# Altium schematic sheet [06] - Audio In-Out.SchDoc: Audio In-Out
size A3; DrawnBy: Farogh; Organization: Farogh Iftekhar; Address1: Defence Coloney; Address2: New Delhi; Revision: V1I0; SheetNumber: 6
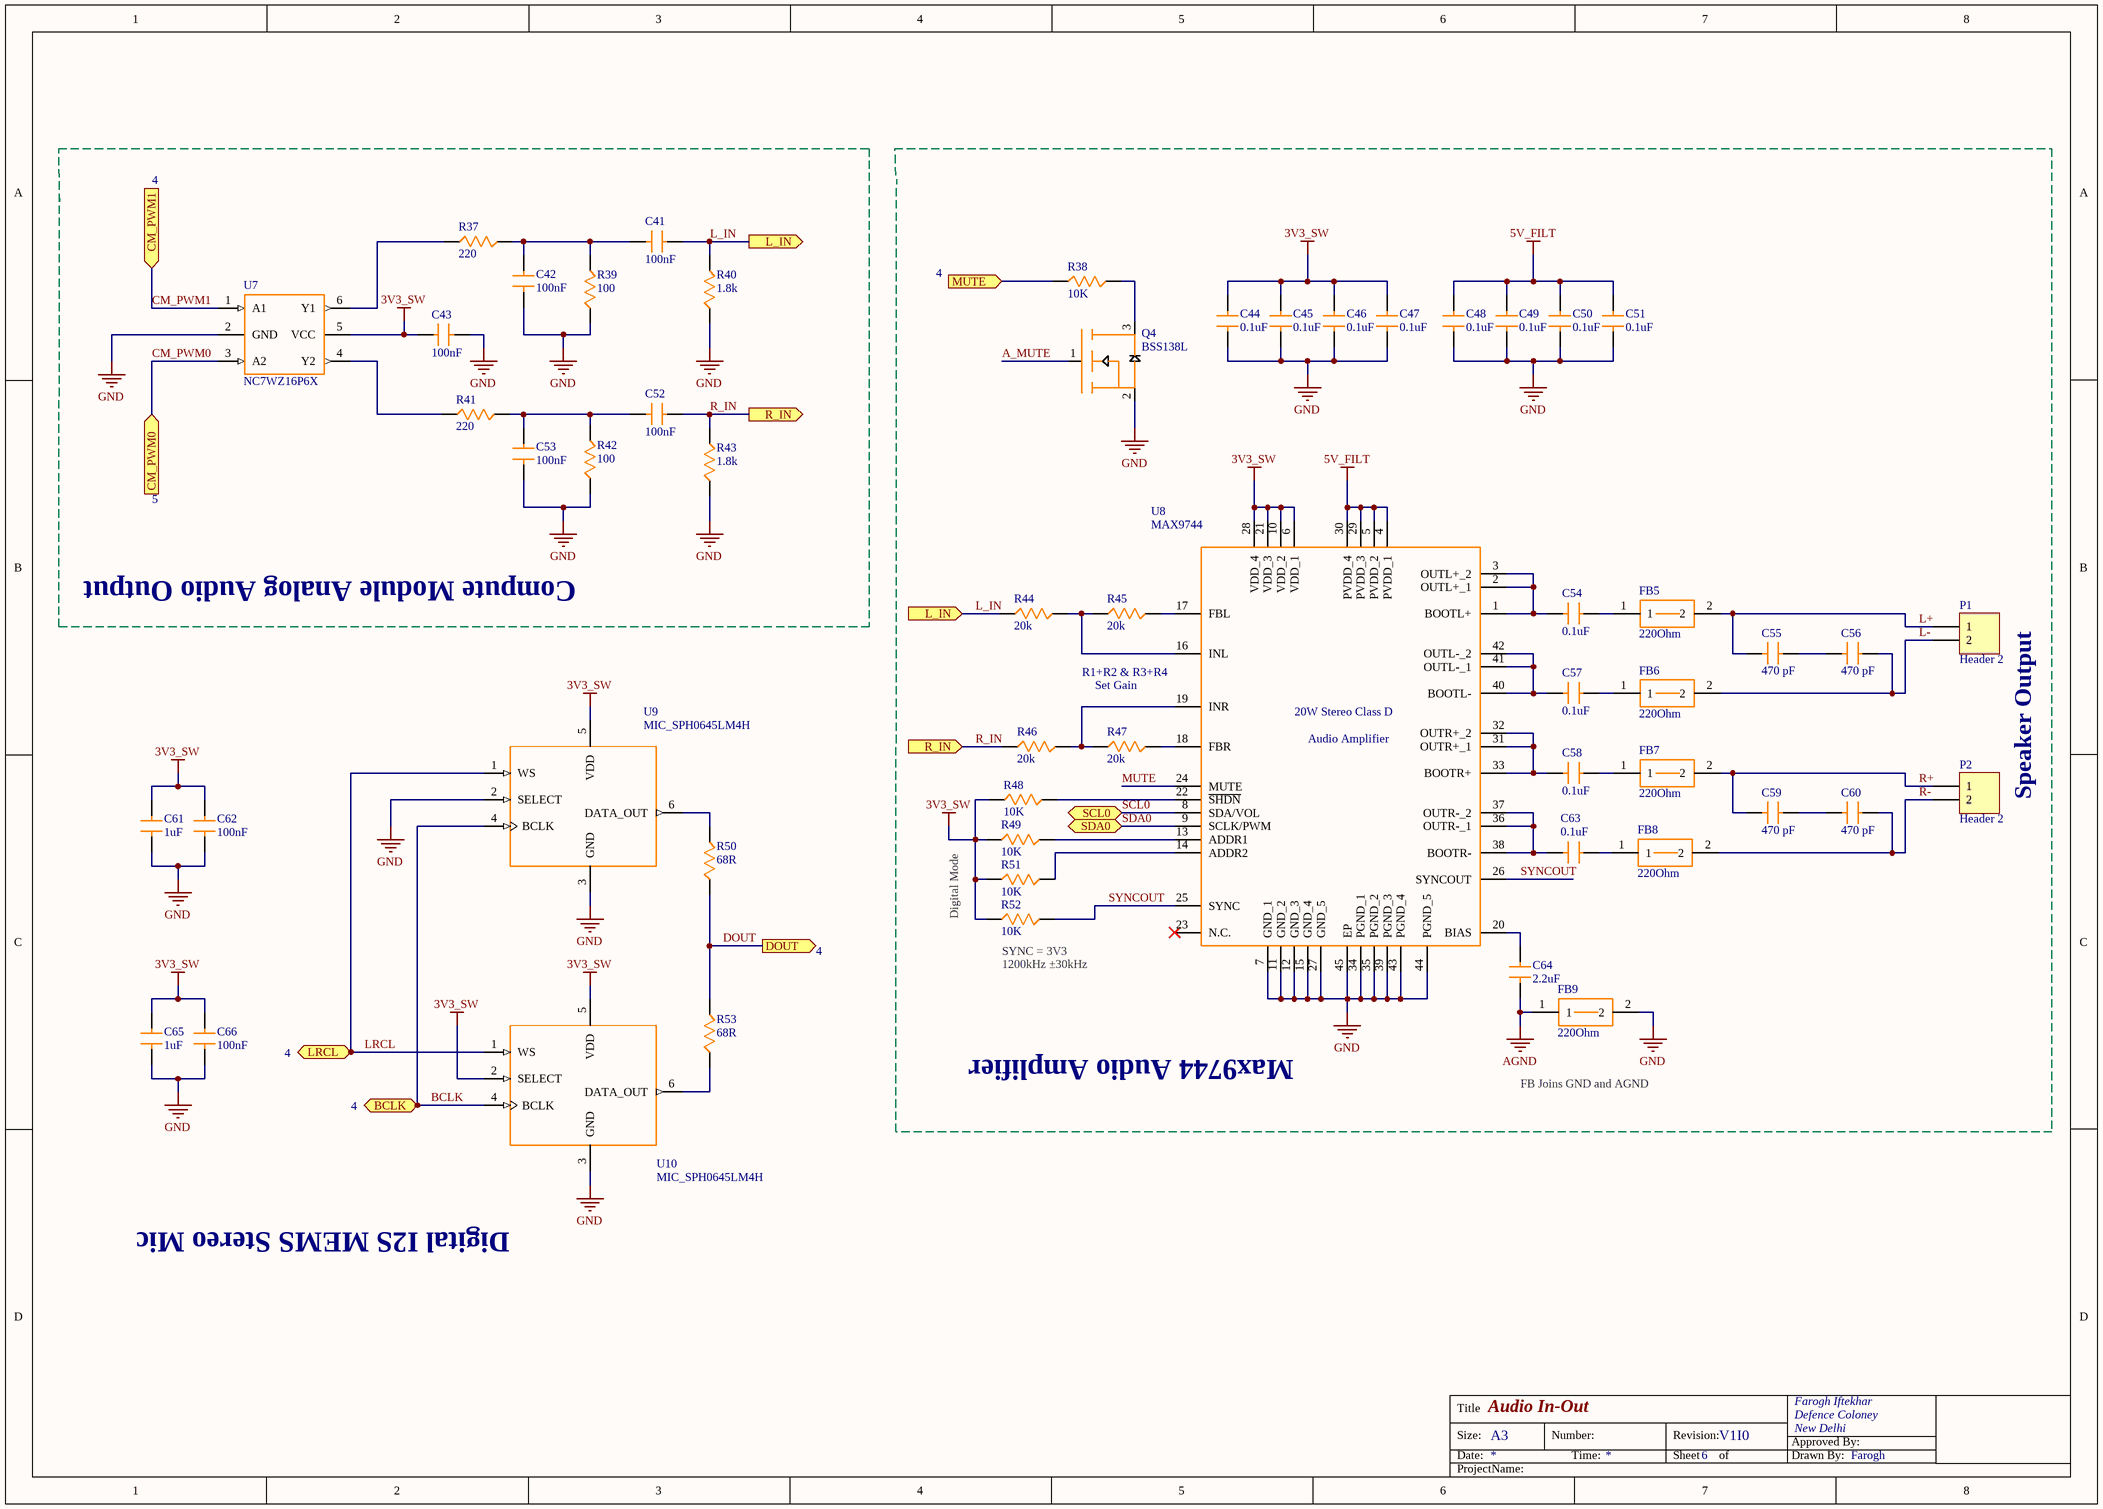
[diagram p0: [06] - Audio In-Out.SchDoc]

## Parts
C41  100nF  [C0805]
C42  100nF  [C0805]
C43  100nF  [C0805]
C44  0.1uF  [C0805]
C45  0.1uF  [C0805]
C46  0.1uF  [C0805]
C47  0.1uF  [C0805]
C48  0.1uF  [C0805]
C49  0.1uF  [C0805]
C50  0.1uF  [C0805]
C51  0.1uF  [C0805]
C52  100nF  [C0805]
C53  100nF  [C0805]
C54  0.1uF  [C0805]
C55  470 pF  [C0805]
C56  470 pF  [C0805]
C57  0.1uF  [C0805]
C58  0.1uF  [C0805]
C59  470 pF  [C0805]
C60  470 pF  [C0805]
C61  1uF  [C0805]
C62  100nF  [C0805]
C63  0.1uF  [C0805]
C64  2.2uF  [C1206]
C65  1uF  [C0805]
C66  100nF  [C0805]
FB5  220Ohm  [FB_0805]
FB6  220Ohm  [FB_0805]
FB7  220Ohm  [FB_0805]
FB8  220Ohm  [FB_0805]
FB9  220Ohm  [FB_0805]
P1  Header 2  [HDR1X2]
P2  Header 2  [HDR1X2]
Q4  BSS138L  [BVSS138L]
R37  220  [R0805]
R38  10K  [R0805]
R39  100  [R0805]
R40  1.8k  [R0805]
R41  220  [R0805]
R42  100  [R0805]
R43  1.8k  [R0805]
R44  20k  [R0805]
R45  20k  [R0805]
R46  20k  [R0805]
R47  20k  [R0805]
R48  10K  [R0805]
R49  10K  [R0805]
R50  68R  [R0805]
R51  10K  [R0805]
R52  10K  [R0805]
R53  68R  [R0805]
U7  NC7WZ16P6X  [SOT65P210X110-6N]
U8  MAX9744  [QFN50P700X700X80-45N]
U9  MIC_SPH0645LM4H  [SPH0645LM4H-B]
U10  MIC_SPH0645LM4H  [SPH0645LM4H-B]

## Ports
BCLK (bidir, see 4), CM_PWM0 (in, see 5), CM_PWM1 (in, see 4), DOUT (out, see 4), L_IN (in), L_IN (out), LRCL (bidir, see 4), MUTE (in, see 4), R_IN (in), R_IN (out), SCL0 (bidir), SDA0

## Nets
3V3_SW: C43.2 C44.2 C45.2 C46.2 C47.2 C61.2 C62.2 C65.2 C66.2 R48.2 R49.2 R51.2 R52.2 U7.5(VCC) U8.6(VDD_1) U8.10(VDD_2) U8.21(VDD_3) U8.28(VDD_4) U9.5(VDD) U10.2(SELECT) U10.5(VDD)
5V_FILT: C48.2 C49.2 C50.2 C51.2 U8.4(PVDD_1) U8.5(PVDD_2) U8.29(PVDD_3) U8.30(PVDD_4)
AGND: C64.1 FB9.1
GND: C42.1 C43.1 C44.1 C45.1 C46.1 C47.1 C48.1 C49.1 C50.1 C51.1 C53.1 C61.1 C62.1 C65.1 C66.1 FB9.2 Q4.2(S) R39.1 R40.1 R42.1 R43.1 U7.2(GND) U8.7(GND_1) U8.11(GND_2) U8.12(GND_3) U8.15(GND_4) U8.27(GND_5) U8.34(PGND_1) U8.35(PGND_2) U8.39(PGND_3) U8.43(PGND_4) U8.44(PGND_5) U8.45(EP) U9.2(SELECT) U9.3(GND) U10.3(GND)
A_MUTE: Q4.1(G)
BCLK: U9.4(BCLK) U10.4(BCLK) ; port BCLK
CM_PWM0: U7.3(A2) ; port CM_PWM0
CM_PWM1: U7.1(A1) ; port CM_PWM1
DOUT: R50.1 R53.2 ; port DOUT
L+: C55.1 FB5.2 P1.1
L-: C56.2 FB6.2 P1.2
L_IN: C41.2 R40.2 R44.1 ; port L_IN
LRCL: U9.1(WS) U10.1(WS) ; port LRCL
MUTE: U8.24(MUTE)
MUTE: R38.2 ; port MUTE  [a separate net that carries the same name]
R+: C59.1 FB7.2 P2.1
R-: C60.2 FB8.2 P2.2
R_IN: C52.2 R43.2 R46.1 ; port R_IN
SCL0: U8.8(SDA/VOL) ; port SCL0
SDA0: U8.9(SCLK/PWM) ; port SDA0
SYNCOUT: R52.1 U8.25(SYNC) U8.26(SYNCOUT)
NetC41_1: C41.1 C42.2 R37.2 R39.2
NetC52_1: C52.1 C53.2 R41.2 R42.2
NetC54_1: C54.1 U8.1(BOOTL+) U8.2(OUTL+_1) U8.3(OUTL+_2)
NetC54_2: C54.2 FB5.1
NetC55_2: C55.2 C56.1
NetC57_1: C57.1 U8.40(BOOTL-) U8.41(OUTL-_1) U8.42(OUTL-_2)
NetC57_2: C57.2 FB6.1
NetC58_1: C58.1 U8.31(OUTR+_1) U8.32(OUTR+_2) U8.33(BOOTR+)
NetC58_2: C58.2 FB7.1
NetC59_2: C59.2 C60.1
NetC63_1: C63.1 U8.36(OUTR-_1) U8.37(OUTR-_2) U8.38(BOOTR-)
NetC63_2: C63.2 FB8.1
NetC64_2: C64.2 U8.20(BIAS)
NetQ4_3: Q4.3(D) R38.1
NetR37_1: R37.1 U7.6(Y1)
NetR41_1: R41.1 U7.4(Y2)
NetR44_2: R44.2 R45.1 U8.16(INL)
NetR45_2: R45.2 U8.17(FBL)
NetR46_2: R46.2 R47.1 U8.19(INR)
NetR47_2: R47.2 U8.18(FBR)
NetR48_1: R48.1 U8.22(~{SHDN})
NetR49_1: R49.1 U8.13(ADDR1)
NetR50_2: R50.2 U9.6(DATA_OUT)
NetR51_1: R51.1 U8.14(ADDR2)
NetR53_1: R53.1 U10.6(DATA_OUT)

Not connected (* = marked no-connect by the designer): U8 23(N.C.)*

## Notes on the sheet
- Compute Module Analog Audio Output
- R1+R2 & R3+R4
- Set Gain
- Speaker Output
- Digital Mode
- (near R52) 1200kHz ±30kHz
- (near R52) SYNC = 3V3
- Max9744 Audio Amplifier
- FB Joins GND and AGND
- Digital I2S MEMS Stereo Mic
- Title
- Size:
- Date:
- A3
- Number:
- Time:
- Revision:
- Sheet
- of
- Approved By:
- Drawn By:
- ProjectName:
- (in symbol MAX9744ETH+T) 20W Stereo Class D; Audio Amplifier

## Library data of the parts
C41-C43 C52 C53 C62 C66 = C_0805-100nF-16V: Multilayer Ceramic Capacitors MLCC - SMD/SMT 100nF 16V 20% Ceramic Capacitor; Manufacturer: Yageo; Manufacturer Part Number: CC0805MRX7R7BB104; Capacitance: 0.1 uF; Type: General Purpose and High Capacitance Surface Mount Ceramic Multilayer Capacitor; Voltage Rating DC: 16 VDC; Capacitance - pF: 100000 pF; Class: Class 2; Dielectric: X7R; Product Status: New at Mouser; Supplier 1: Mouser; Category: Multilayer Ceramic Capacitors MLCC - SMD/SMT; Stock 1: 15850; Pricing 1: 1=0.240, 10=0.114, 100=0.057, 1000=0.049, 4000=0.036, 8000=0.034, 24000=0.033, 48000=0.031, 100000=0.026 (USD); Height: 0.85 mm; Length: 2 mm; Package / Case: 0805 (2012 metric); Packaging: Cut Tape; Product: General Type MLCCs; Series: CC; Termination Style: SMD/SMT; Tolerance: 20 %; Width: 1.25 mm; Brand: Yageo; Capacitance - nF: 100 nF; Case Code - in: 0805; Case Code - mm: 2012; Maximum Operating Temperature: + 125 C; Minimum Operating Temperature: - 55 C; Product Type: Ceramic Capacitors; Standard Pack Qty: 4000; Subcategory: Capacitors; Termination: Standard; Minimum Order Quantity: 1; Reeling: True; ComponentLink1URL: https://www.mouser.com/datasheet/2/447/UPY-GPHC_X7R_6.3V-to-50V_18-1154002.pdf; ComponentLink1Description: https://www.mouser.com/datasheet/2/447/UPY-GPHC_X7R_6.3V-to-50V_18-1154002.pdf; Supplier Part Number 1: 603-CC0805MRX77BB104
C44-C51 C54 C57 C58 C63 = C_0805-0.1uF: Multilayer Ceramic Capacitors MLCC - SMD/SMT 0.1uF 10% 50V AEC-Q200; Manufacturer: Yageo; Manufacturer Part Number: AS0805KKX7R9BB104; Voltage Rating DC: 50 VDC; Capacitance - nF: 100 nF; Capacitance - pF: 100000 pF; CNHTS: 8532241000; Dielectric: X7R; TARIC: 8532240000; Product Status: New Product; Supplier 1: Mouser; RoHS: RoHS Compliant; Category: Multilayer Ceramic Capacitors MLCC - SMD/SMT; Stock 1: 30283; Pricing 1: 1=0.670, 10=0.461, 100=0.262, 500=0.238, 1000=0.165, 3000=0.156, 6000=0.146, 9000=0.136, 24000=0.122 (USD); Capacitance: 0.1 uF; Height: 1.25 mm; Length: 2 mm; Package / Case: 0805 (2012 metric); Packaging: Cut Tape; Product: Automotive MLCCs; Series: AS; Termination Style: SMD/SMT; Tolerance: 10 %; Width: 1.25 mm; Brand: Yageo; Case Code - in: 0805; Case Code - mm: 2212; HTS Code: 8532240020; Maximum Operating Temperature: + 125 C; Minimum Operating Temperature: - 55 C; Product Type: Ceramic Capacitors; Standard Pack Qty: 3000; Subcategory: Capacitors; Termination: Flexible (Soft); RoHS - Mouser: Y; Minimum Order Quantity: 1; Reeling: True; ComponentLink1URL: http://www.mouser.com/datasheet/2/447/yageodocoutput-1313910.pdf; ComponentLink1Description: http://www.mouser.com/datasheet/2/447/yageodocoutput-1313910.pdf; Supplier Part Number 1: 603-AS0805KKX79BB104
C55 C56 C59 C60 = C_0805-470 pF: Multilayer Ceramic Capacitors MLCC - SMD/SMT 50V 470pF X7R 0805 10% AEC-Q200; Manufacturer: KEMET; Manufacturer Part Number: C0805S471K5RACAUTO; Voltage Rating DC: 50 VDC; Capacitance - nF: 0.47 nF; Product Status: New Product; Supplier 1: Mouser; RoHS: RoHS Compliant; Category: Multilayer Ceramic Capacitors MLCC - SMD/SMT; Stock 1: 7003; Pricing 1: 1=0.370, 10=0.217, 100=0.131, 500=0.119, 1000=0.108, 4000=0.079, 8000=0.072, 24000=0.070, 48000=0.062 (USD); Capacitance: 470 pF; Height: 0.78 mm; Length: 2 mm; Package / Case: 0805 (2012 metric); Packaging: Cut Tape; Product: Automotive MLCCs; Series: SMD Auto X7R FE; Termination Style: SMD/SMT; Tolerance: 10 %; Width: 1.25 mm; Brand: KEMET; Case Code - in: 0805; Case Code - mm: 2012; Dielectric: X7R; Maximum Operating Temperature: + 125 C; Minimum Operating Temperature: - 55 C; Product Type: Ceramic Capacitors; Qualification: AEC-Q200; Standard Pack Qty: 4000; Subcategory: Capacitors; Termination: Standard; Tradename: FE-CAP; RoHS - Mouser: Y; Minimum Order Quantity: 1; Reeling: True; ComponentLink1URL: https://www.mouser.com/datasheet/2/212/KEM_C1014_X7R_FE-CAP_SMD-1102761.pdf; ComponentLink1Description: https://www.mouser.com/datasheet/2/212/KEM_C1014_X7R_FE-CAP_SMD-1102761.pdf
C61 C65 = C_0805-1uF: Multilayer Ceramic Capacitors MLCC - SMD/SMT 10V 1uF X7R 0805 10%; Manufacturer: KEMET; Manufacturer Part Number: C0805C105K8RAC7210; Voltage Rating DC: 10 VDC; Capacitance - nF: 1000 nF; Class: Class 2; Product Status: New Product; Supplier 1: Mouser; RoHS: RoHS Compliant; Category: Multilayer Ceramic Capacitors MLCC - SMD/SMT; Stock 1: 38596; Pricing 1: 1=0.230, 10=0.104, 100=0.064, 500=0.057, 1000=0.048, 2000=0.041, 10000=0.036, 15000=0.032, 45000=0.028 (USD); Capacitance: 1 uF; Height: 0.9 mm; Length: 2 mm; Package / Case: 0805 (2012 metric); Packaging: Cut Tape; Product: General Type MLCCs; Series: SMD Comm X7R; Termination Style: SMD/SMT; Tolerance: 10 %; Width: 1.25 mm; Brand: KEMET; Case Code - in: 0805; Case Code - mm: 2012; Dielectric: X7R; Maximum Operating Temperature: + 125 C; Minimum Operating Temperature: - 55 C; Product Type: Ceramic Capacitors; Standard Pack Qty: 15000; Subcategory: Capacitors; Termination: Standard; RoHS - Mouser: Y; Minimum Order Quantity: 1; Reeling: True; ComponentLink1URL: https://www.mouser.com/datasheet/2/212/KEM_C1002_X7R_SMD-1102033.pdf; ComponentLink1Description: https://www.mouser.com/datasheet/2/212/KEM_C1002_X7R_SMD-1102033.pdf; Supplier Part Number 1: 80-C0805C105K8R7210
C64 = C_1206-2.2uF: Multilayer Ceramic Capacitors MLCC - SMD/SMT 25V 2.2uF X7R 1206 10%; Manufacturer: KEMET; Manufacturer Part Number: C1206C225K3REC7210; Voltage Rating DC: 25 VDC; Capacitance - nF: 2200 nF; Class: Class 2; CNHTS: 8532241000; TARIC: 8532240000; Product Status: New Product; Supplier 1: Mouser; RoHS: RoHS Compliant; Category: Multilayer Ceramic Capacitors MLCC - SMD/SMT; Stock 1: 7554; Pricing 1: 1=0.230, 10=0.121, 100=0.073, 500=0.065, 1000=0.051, 5000=0.045, 8000=0.041, 24000=0.039, 48000=0.035 (USD); Capacitance: 2.2 uF; Height: 1.6 mm; Length: 3.2 mm; Package / Case: 1206 (3216 metric); Packaging: Cut Tape; Product: General Type MLCCs; Series: ESD SMD Comm X7R; Termination Style: SMD/SMT; Tolerance: 10 %; Width: 1.6 mm; Brand: KEMET; Case Code - in: 1206; Case Code - mm: 3216; Dielectric: X7R; HTS Code: 8532240020; Maximum Operating Temperature: + 125 C; Minimum Operating Temperature: - 55 C; Product Type: Ceramic Capacitors; Standard Pack Qty: 8000; Subcategory: Capacitors; Termination: Standard; RoHS - Mouser: Y; Minimum Order Quantity: 1; Reeling: True; ComponentLink1URL: http://www.mouser.com/datasheet/2/212/KEM_C1090_X7R_ESD-1103328.pdf; ComponentLink1Description: http://www.mouser.com/datasheet/2/212/KEM_C1090_X7R_ESD-1103328.pdf; Supplier Part Number 1: 80-C1206C225K3RECLR
FB5-FB9 = FB_0805-220, 3000mA: Ferrite Beads NEW MFG PN 810-MPZ2012S221AT000; Manufacturer: TDK; Impedance: 220 Ohms; Maximum DC Current: 3 A; Maximum DC Resistance: 40 mOhms; Tolerance: 25 %; Type: Chip Bead SMD for Power Line; Test Frequency: 100 MHz; Product Status: Part Number Change; Supplier 1: Mouser; Manufacturer Part Number: MPZ2012S221A; RoHS: RoHS Compliant; Category: Ferrite Beads; Stock 1: 24645; Pricing 1: 1=0.120, 10=0.101, 100=0.046, 500=0.039, 1000=0.033, 4000=0.028, 8000=0.024, 48000=0.023 (USD); Capacitance: -; Height: 0.85 mm; Length: 2 mm; Operating Temperature Range: - 55 C to + 125 C; Package / Case: 0805 (2012 metric); Packaging: Cut Tape; Product: Ferrite Chip Beads; Series: MPZ; Termination Style: SMD/SMT; Width: 1.25 mm; Brand: TDK; Maximum Operating Temperature: + 125 C; Minimum Operating Temperature: - 55 C; Product Type: Ferrite Beads; Standard Pack Qty: 4000; Subcategory: Ferrites; Termination: -; RoHS - Mouser: Y; Minimum Order Quantity: 1; Reeling: True; ComponentLink1URL: https://www.mouser.com/datasheet/2/400/eads_commercial_power_mpz2012_en-923646.pdf; ComponentLink1Description: https://www.mouser.com/datasheet/2/400/eads_commercial_power_mpz2012_en-923646.pdf; Supplier Part Number 1: 810-MPZ2012S221A
P1 P2 = Header 2: Header, 2-Pin; LatestRevisionDate: 17-Jul-2002; LatestRevisionNote: Re-released for DXP Platform.; Publisher: Altium Limited
Q4 = BSS138L: MOSFET FET 50V 3.5 OHM SOT23; Manufacturer: ON Semiconductor / Fairchild; Configuration: Single; Transistor Type: 1 N-Channel; Forward Transconductance - Min: 120 mS; Number of Channels: 1 Channel; Transistor Polarity: N-Channel; Channel Mode: Enhancement; CNHTS: 8541290000; Fall Time: 5.1 ns; Id - Continuous Drain Current: 200 mA; MXHTS: 85412999; Pd - Power Dissipation: 350 mW; Qg - Gate Charge: 549 pC; Rise Time: 1.8 ns; Typical Turn-Off Delay Time: 5.3 ns; Typical Turn-On Delay Time: 2.2 ns; Vgs - Gate-Source Voltage: 20 V; Vgs th - Gate-Source Threshold Voltage: 1.25 V; Supplier 1: Mouser; Manufacturer Part Number: BSS138L; RoHS: RoHS Compliant; Category: MOSFET; Stock 1: 227181; Pricing 1: 1=0.260, 10=0.180, 100=0.075, 1000=0.052, 3000=0.040, 9000=0.035, 24000=0.032, 45000=0.030 (USD); Height: 1.2 mm; Length: 2.9 mm; Package / Case: SOT-23-3; Packaging: Cut Tape; Series: BSS138L; Technology: Si; Width: 1.3 mm; Brand: ON Semiconductor / Fairchild; Mounting Style: SMD/SMT; HTS Code: 8541210095; Maximum Operating Temperature: + 150 C; Minimum Operating Temperature: - 55 C; Product Type: MOSFET; Rds On - Drain-Source Resistance: 3.5 Ohms; Standard Pack Qty: 3000; Subcategory: MOSFETs; TARIC: 8541290000; Vds - Drain-Source Breakdown Voltage: 50 V; RoHS - Mouser: Y; Minimum Order Quantity: 1; Reeling: True; ComponentLink1URL: http://www.mouser.com/datasheet/2/308/BSS138L-1300146.pdf; ComponentLink1Description: http://www.mouser.com/datasheet/2/308/BSS138L-1300146.pdf; Supplier Part Number 1: 512-BSS138L
R37 R41 = R_0805-220: Thin Film Resistors - SMD; Manufacturer: Yageo; Manufacturer Part Number: RT0805DRE07220RL; Power Rating: 125 mW (1/8 W); Resistance: 220 Ohms; Temperature Coefficient: 50 PPM / C; Tolerance: 0.5 %; Voltage Rating: 150 V; CNHTS: 8533211000; MXHTS: 85332101; TARIC: 8533210000; Supplier 1: Mouser; RoHS: RoHS Compliant; Category: Thin Film Resistors - SMD; Stock 1: 14351; Pricing 1: 1=0.170, 10=0.088, 100=0.031, 1000=0.022, 5000=0.015, 10000=0.014, 25000=0.013, 50000=0.012 (USD); Features: -; Height: 0.5 mm; Length: 2 mm; Operating Temperature Range: - 55 C to + 125 C; Packaging: Cut Tape; Product: Thin Film Resistors SMD; Series: RT; Technology: Thin Film; Termination Style: SMD/SMT; Type: High Precision, High Stability; Width: 1.2 mm; Brand: Yageo; Mounting Style: PCB Mount; Case Code - in: 0805; Case Code - mm: 2012; HTS Code: 8533210030; Maximum Operating Temperature: + 125 C; Minimum Operating Temperature: - 55 C; Product Type: Thin Film Resistors; Standard Pack Qty: 5000; Subcategory: Resistors; RoHS - Mouser: Y; Minimum Order Quantity: 1; Reeling: True; ComponentLink1URL: https://www.mouser.com/datasheet/2/447/PYu-RT_1-to-0.01_RoHS_L_9-1222720.pdf; ComponentLink1Description: https://www.mouser.com/datasheet/2/447/PYu-RT_1-to-0.01_RoHS_L_9-1222720.pdf; Supplier Part Number 1: 603-RT0805DRE07220RL
R38 R48 R49 R51 R52 = R_0805-10K: Thick Film Resistors - SMD 10K   OHM   1% 1/4W; Manufacturer: Yageo; Manufacturer Part Number: RC0805FR-7W10KL; Power Rating: 125 mW, 250 mW; Resistance: 10 kOhms; Temperature Coefficient: 100 PPM / C; Voltage Rating: 150 V; CNHTS: 8533211000; MXHTS: 85332101; TARIC: 8533210000; Supplier 1: Mouser; RoHS: RoHS Compliant; Category: Thick Film Resistors - SMD; Stock 1: 8240; Pricing 1: 1=0.190, 10=0.115, 100=0.038, 1000=0.026, 5000=0.020, 10000=0.019, 25000=0.018, 100000=0.017 (USD); Application: High Reliability; Features: -; Height: 0.5 mm; Length: 2 mm; Package / Case: 0805 (2012 metric); Packaging: Cut Tape; Product: Thick Film Resistors SMD; Series: RC; Technology: Thick Film; Termination Style: SMD/SMT; Tolerance: 1 %; Type: High Power; Width: 1.25 mm; Brand: Yageo; Mounting Style: PCB Mount; Case Code - in: 0805; Case Code - mm: 2012; HTS Code: 8533210030; Maximum Operating Temperature: + 155 C; Minimum Operating Temperature: - 55 C; Product Type: Thick Film Resistors; Standard Pack Qty: 5000; Subcategory: Resistors; RoHS - Mouser: Y; Minimum Order Quantity: 1; Reeling: True; ComponentLink1URL: http://www.mouser.com/datasheet/2/447/yageo_01152019_DESIGN_KITS_8_2012-1522572.pdf; ComponentLink1Description: http://www.mouser.com/datasheet/2/447/yageo_01152019_DESIGN_KITS_8_2012-1522572.pdf; Supplier Part Number 1: 603-RC0805FR-7W10KL
R39 R42 = R_0805-100: Thin Film Resistors - SMD 100Ohm,0805,1%,25ppm ,100mW,100V; Manufacturer: KOA Speer; Manufacturer Part Number: RN732ATTDK1000F25; Power Rating: 100 mW (1/10 W); Resistance: 100 Ohms; Temperature Coefficient: 25 PPM / C; Voltage Rating: 150 V; CNHTS: 8533211000; MXHTS: 85332101; TARIC: 8533210000; Supplier 1: Mouser; RoHS: RoHS Compliant; Category: Thin Film Resistors - SMD; Stock 1: 1015; Pricing 1: 1=0.230, 25=0.133, 50=0.127, 100=0.118, 250=0.115, 500=0.107, 1000=0.105, 2000=0.099 (USD); Features: -; Height: 0.5 mm; Length: 2 mm; Operating Temperature Range: - 55 C to + 155 C; Package / Case: 0805 (2012 metric); Packaging: Cut Tape; Product: Precision Resistors Thin Film SMD; Series: RN73; Termination Style: SMD/SMT; Tolerance: 1 %; Type: Thin Film (Metal) Chip Resistor-Ultra High Precision Tolerance; Width: 1.25 mm; Brand: KOA Speer; Case Code - in: 0805; Case Code - mm: 2012; HTS Code: 8533210030; Maximum Operating Temperature: + 155 C; Minimum Operating Temperature: - 55 C; Product Type: Thin Film Resistors; Standard Pack Qty: 1000; Subcategory: Resistors; RoHS - Mouser: Y; Minimum Order Quantity: 1; Reeling: True; ComponentLink1URL: http://www.mouser.com/datasheet/2/219/RN73-11994.pdf; ComponentLink1Description: http://www.mouser.com/datasheet/2/219/RN73-11994.pdf; Supplier Part Number 1: 660-RN732ATTDK1000F2
R40 R43 = R_0805-1.8K: Thin Film Resistors - SMD; Manufacturer: Yageo; Manufacturer Part Number: RT0805CRE071K8L; Power Rating: 125 mW (1/8 W); Resistance: 1.8 kOhms; Temperature Coefficient: 50 PPM / C; Tolerance: 0.25 %; Voltage Rating: 150 V; CNHTS: 8533211000; MXHTS: 85332101; TARIC: 8533210000; Supplier 1: Mouser; RoHS: RoHS Compliant; Category: Thin Film Resistors - SMD; Stock 1: 4680; Pricing 1: 1=0.430, 10=0.249, 100=0.100, 1000=0.076, 5000=0.059, 10000=0.057, 25000=0.055, 50000=0.054 (USD); Features: -; Height: 0.5 mm; Length: 2 mm; Operating Temperature Range: - 55 C to + 125 C; Package / Case: 0805 (2012 metric); Packaging: Cut Tape; Product: Thin Film Resistors SMD; Series: RT; Termination Style: SMD/SMT; Type: High Precision, High Stability; Width: 1.25 mm; Brand: Yageo; Case Code - in: 0805; Case Code - mm: 2012; HTS Code: 8533210030; Maximum Operating Temperature: + 125 C; Minimum Operating Temperature: - 55 C; Standard Pack Qty: 5000; RoHS - Mouser: Y; Minimum Order Quantity: 1; Reeling: True; ComponentLink1URL: http://www.mouser.com/datasheet/2/447/PYu-RT_1-to-0.01_RoHS_L_9-1222720.pdf; ComponentLink1Description: http://www.mouser.com/datasheet/2/447/PYu-RT_1-to-0.01_RoHS_L_9-1222720.pdf; Supplier Part Number 1: 603-RT0805CRE071K8L
R44-R47 = R_0805-20K: Thin Film Resistors - SMD 20 Kohms 0.1% Tol. AEC-Q200; Manufacturer: Yageo; Manufacturer Part Number: AT0805BRD0720KL; Power Rating: 125 mW (1/8 W); Temperature Coefficient: 25 PPM / C; Voltage Rating: 150 V; CNHTS: 8533211000; MXHTS: 85332101; TARIC: 8533210000; Supplier 1: Mouser; RoHS: RoHS Compliant; Category: Thin Film Resistors - SMD; Stock 1: 4947; Pricing 1: 1=0.590, 10=0.416, 100=0.236, 1000=0.191, 5000=0.164, 10000=0.159, 25000=0.155, 50000=0.154 (USD); Diameter: -; Features: -; Height: 0.5 mm; Length: 2 mm; Operating Temperature Range: - 55 C to + 125 C; Package / Case: 0805 (2012 metric); Packaging: Cut Tape; Product: Thin Film Resistors SMD; Resistance: 20 kOhms; Series: AT; Termination Style: SMD/SMT; Tolerance: 0.1 %; Type: High Precision High Stability Chip Resistors; Width: 1.25 mm; Brand: Yageo; Case Code - in: 0805; Case Code - mm: 2012; HTS Code: 8533210030; Maximum Operating Temperature: + 125 C; Minimum Operating Temperature: - 55 C; Qualification: AEC-Q200; Standard Pack Qty: 5000; RoHS - Mouser: Y; Minimum Order Quantity: 1; Reeling: True; ComponentLink1URL: http://www.mouser.com/datasheet/2/447/PYu-AT_51_RoHS_L_5-1222714.pdf; ComponentLink1Description: http://www.mouser.com/datasheet/2/447/PYu-AT_51_RoHS_L_5-1222714.pdf; Supplier Part Number 1: 603-AT0805BRD0720KL
R50 R53 = R_0805-68R: Thick Film Resistors - SMD 1/8Watt 68ohms 1% Commercial Use; Manufacturer: Vishay / Dale; Manufacturer Part Number: CRCW080568R0FKEAC; Power Rating: 125 mW (1/8 W); Temperature Coefficient: 100 PPM / C; Voltage Rating: 150 V; Product Status: New Product; Supplier 1: Mouser; RoHS: RoHS Compliant By Exemption; Category: Thick Film Resistors - SMD; Stock 1: 27467; Pricing 1: 1=0.180, 10=0.083, 100=0.048, 500=0.026, 1000=0.015, 5000=0.010, 10000=0.007, 25000=0.006, 50000=0.005 (USD); Features: -; Length: 2 mm; Package / Case: -; Packaging: Cut Tape; Product: Thick Film Resistors SMD; Resistance: 68 Ohms; Series: CRCW-C e3; Technology: Thick Film; Termination Style: SMD/SMT; Tolerance: 1 %; Width: 1.25 mm; Brand: Vishay / Dale; Mounting Style: PCB Mount; Case Code - in: 0805; Case Code - mm: 2012; Maximum Operating Temperature: + 155 C; Minimum Operating Temperature: - 55 C; Product Type: Thick Film Resistors; Standard Pack Qty: 5000; Subcategory: Resistors; RoHS - Mouser: E; Minimum Order Quantity: 1; Reeling: True; ComponentLink1URL: https://www.mouser.com/datasheet/2/427/crcwce3-1223726.pdf; ComponentLink1Description: https://www.mouser.com/datasheet/2/427/crcwce3-1223726.pdf
U7 = NC7WZ16P6X: Buffers & Line Drivers UHS Dual Buffer; Manufacturer: ON Semiconductor / Fairchild; Quiescent Current: 1 uA; Logic Family: TinyLogic UHS; Logic Type: CMOS; Number of Channels: 2; Number of Input Lines: 2 Input; Number of Output Lines: 2 Output; High Level Output Current: - 32 mA; Input Signal Type: Single-Ended; Low Level Output Current: 32 mA; Operating Supply Voltage: 1.65 V to 5.5 V; Pd - Power Dissipation: 180 mW; Polarity: Non-Inverting; Propagation Delay Time: 4.6 ns at 3.3 V, 3.8 ns at 5 V; Supply Voltage - Max: 5.5 V; Supply Voltage - Min: 1.65 V; Supplier 1: Mouser; Manufacturer Part Number: NC7WZ16P6X; RoHS: RoHS Compliant; Category: Buffers & Line Drivers; Stock 1: 31573; Pricing 1: 1=0.440, 10=0.285, 100=0.122, 1000=0.093, 3000=0.071, 9000=0.063, 24000=0.059, 45000=0.057 (USD); Function: Buffer; Height: 1 mm; Length: 2 mm; Package / Case: SC-70-6; Packaging: Cut Tape; Series: NC7WZ16; Technology: CMOS; Width: 1.25 mm; Brand: ON Semiconductor / Fairchild; Mounting Style: SMD/SMT; Supply Current - Max: 1 uA; Maximum Operating Temperature: + 85 C; Minimum Operating Temperature: - 40 C; Product Type: Buffers & Line Drivers; Standard Pack Qty: 3000; Subcategory: Logic ICs; Tradename: TinyLogic; RoHS - Mouser: Y; Minimum Order Quantity: 1; Reeling: True; ComponentLink1URL: https://www.mouser.com/datasheet/2/308/NC7WZ16-1301496.pdf; ComponentLink1Description: https://www.mouser.com/datasheet/2/308/NC7WZ16-1301496.pdf
U8 = MAX9744ETH+T: Audio Amplifiers Stereo 20W Class D Amplifier; Manufacturer: Maxim Integrated; Audio - Load Impedance: 4 Ohms; THD plus Noise: 0.04 %; Class: Class-D; Operating Supply Current: 20 mA; Pd - Power Dissipation: 2963 mW; PSRR - Power Supply Rejection Ratio: 75 dB; Supplier 1: Mouser; Manufacturer Part Number: MAX9744ETH+T; RoHS: RoHS Compliant; Category: Audio Amplifiers; Stock 1: 6566; Pricing 1: 1=5.32, 10=4.77, 25=4.51, 50=3.95, 100=3.91, 250=3.71, 500=3.32, 1000=2.56, 2500=2.56 (USD); Output Power: 20 W; Packaging: Cut Tape; Product: Audio Amplifiers; Series: MAX9744; Brand: Maxim Integrated; Maximum Operating Temperature: + 85 C; Minimum Operating Temperature: - 40 C; Product Type: Audio Amplifiers; Standard Pack Qty: 2500; Subcategory: Audio ICs; RoHS - Mouser: Y; Minimum Order Quantity: 1; Reeling: True; ComponentLink1URL: https://www.mouser.com/datasheet/2/256/MAX9744-1513525.pdf; ComponentLink1Description: https://www.mouser.com/datasheet/2/256/MAX9744-1513525.pdf
U9 U10 = MIC_SPH0645LM4H-B: MEMS Microphones DIG MEMs Mic, BP w/ I2S output; Manufacturer: Knowles; Directional Properties: Omnidirectional; Frequency Range: 10 Hz to 10 kHz; Output Type: Digital; Port Type: Bottom; Sensitivity: - 26 dB; Sound Pressure Level: 120 dB; Tolerance: 1 dB; Shape: Rectangular; Operating Supply Current: 600 uA; Operating Supply Voltage: 3.6 V; SNR - Signal to Noise Ratio: 65 dB; Supply Voltage - Min: 1.62 V; Supplier 1: Mouser; Manufacturer Part Number: SPH0645LM4H-B; RoHS: RoHS Compliant; Category: MEMS Microphones; Stock 1: 37799; Pricing 1: 1=2.64, 10=2.28, 25=1.80, 100=1.73, 250=1.71, 500=1.58, 1000=1.56, 2500=1.38, 5900=1.27 (USD); Depth: 1.08 mm; Impedance: -; Length: 3.5 mm; Packaging: Cut Tape; Series: SPH; Technology: MEMS; Termination Style: SMD/SMT; Type: Silicon MEMS Microphone; Width: 2.65 mm; Brand: Knowles; Mounting Style: SMD/SMT; Maximum Operating Temperature: + 100 C; Minimum Operating Temperature: - 40 C; Product Type: MEMS Microphones; Standard Pack Qty: 5900; Subcategory: Microphones; Supply Voltage - Max: 3.6 V; Tradename: SiSonic; RoHS - Mouser: Y; Minimum Order Quantity: 1; Reeling: True; ComponentLink1URL: https://www.mouser.com/datasheet/2/218/ph0645lm4h-b-datasheet-rev-c-1525723.pdf; ComponentLink1Description: https://www.mouser.com/datasheet/2/218/ph0645lm4h-b-datasheet-rev-c-1525723.pdf